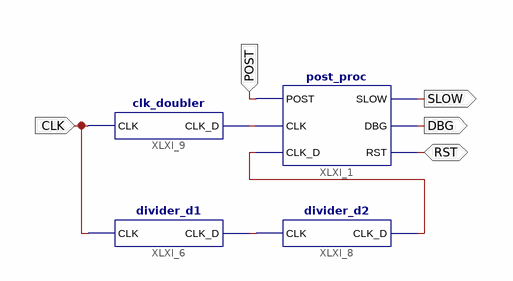
[diagram p0: schematic sheet 1]
// Xilinx ISE schematic overall.sch (xbr) as structural Verilog: 4 symbols, 5 ports
module overall (
  input  POST,
  input  CLK,
  inout  RST,
  output DBG,
  output SLOW
);

  wire XLXN_24, XLXN_40, XLXN_41;

  clk_doubler XLXI_9 (.CLK(CLK), .CLK_D(XLXN_24));
  divider_d2 XLXI_8 (.CLK(XLXN_40), .CLK_D(XLXN_41));
  divider_d1 XLXI_6 (.CLK(CLK), .CLK_D(XLXN_40));
  post_proc XLXI_1 (.POST(POST), .SLOW(SLOW), .DBG(DBG), .RST(RST), .CLK(XLXN_24), .CLK_D(XLXN_41));
endmodule
